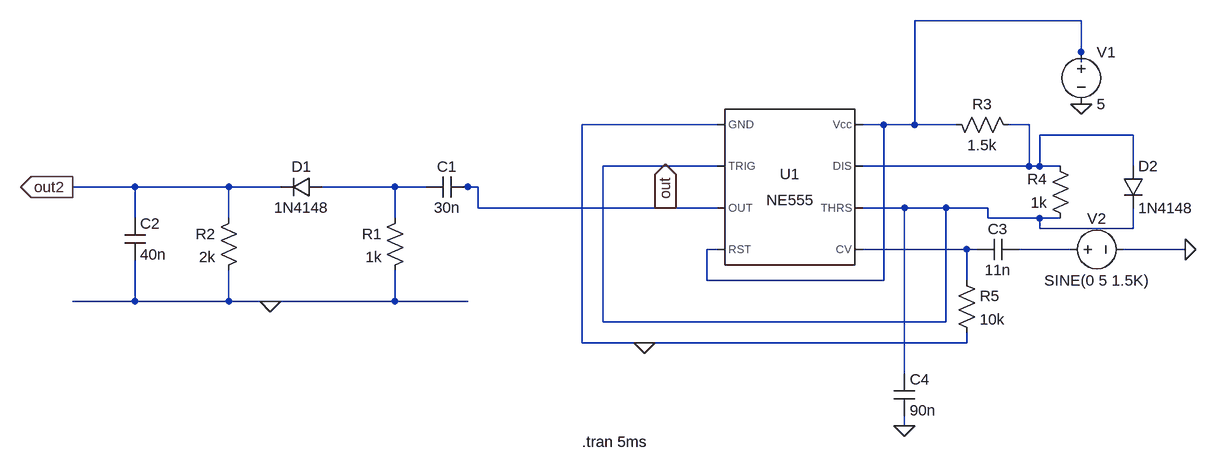
[diagram p0: schematic FM demodulation.asc]
FM demodulation.asc, the LTspice schematic file:
Version 4
SHEET 1 2008 680
WIRE 1824 -192 1568 -192
WIRE 1824 -144 1824 -192
WIRE 1824 -128 1824 -144
WIRE 1264 -32 1056 -32
WIRE 1520 -32 1488 -32
WIRE 1568 -32 1568 -192
WIRE 1568 -32 1520 -32
WIRE 1632 -32 1568 -32
WIRE 1744 -32 1712 -32
WIRE 1904 -16 1760 -16
WIRE 1264 32 1088 32
WIRE 1744 32 1744 -32
WIRE 1744 32 1488 32
WIRE 1760 32 1760 -16
WIRE 1760 32 1744 32
WIRE 1792 32 1760 32
WIRE 1904 32 1904 -16
WIRE 368 64 272 64
WIRE 512 64 368 64
WIRE 592 64 512 64
WIRE 768 64 656 64
WIRE 816 64 768 64
WIRE 880 64 864 64
WIRE 896 64 880 64
WIRE 896 96 896 64
WIRE 1184 96 896 96
WIRE 1264 96 1184 96
WIRE 1552 96 1488 96
WIRE 1616 96 1552 96
WIRE 1680 96 1616 96
WIRE 368 112 368 64
WIRE 512 112 512 64
WIRE 768 112 768 64
WIRE 1680 112 1680 96
WIRE 1760 112 1680 112
WIRE 1792 112 1760 112
WIRE 1760 128 1760 112
WIRE 1904 128 1904 96
WIRE 1904 128 1760 128
WIRE 1264 160 1248 160
WIRE 1648 160 1488 160
WIRE 1664 160 1648 160
WIRE 1808 160 1728 160
WIRE 1984 160 1888 160
WIRE 1248 208 1248 160
WIRE 1520 208 1520 -32
WIRE 1520 208 1248 208
WIRE 1648 208 1648 160
WIRE 368 240 368 176
WIRE 368 240 272 240
WIRE 512 240 512 192
WIRE 512 240 368 240
WIRE 576 240 512 240
WIRE 768 240 768 192
WIRE 768 240 576 240
WIRE 880 240 768 240
WIRE 1088 272 1088 32
WIRE 1616 272 1616 96
WIRE 1616 272 1088 272
WIRE 1056 304 1056 -32
WIRE 1152 304 1056 304
WIRE 1648 304 1648 288
WIRE 1648 304 1152 304
WIRE 1552 352 1552 96
WIRE 1552 432 1552 416
FLAG 1184 96 out
IOPIN 1184 96 Out
FLAG 1824 -64 0
FLAG 1984 160 0
FLAG 1152 304 0
FLAG 1552 432 0
FLAG 576 240 0
FLAG 272 64 out2
IOPIN 272 64 Out
SYMBOL diode 656 80 M270
WINDOW 0 32 32 VTop 2
WINDOW 3 0 32 VBottom 2
SYMATTR InstName D1
SYMATTR Value 1N4148
SYMBOL res 784 96 M0
SYMATTR InstName R1
SYMATTR Value 1k
SYMBOL res 528 96 M0
SYMATTR InstName R2
SYMATTR Value 2k
SYMBOL cap 816 48 M90
WINDOW 0 0 32 VBottom 2
WINDOW 3 32 32 VTop 2
SYMATTR InstName C1
SYMATTR Value 30n
SYMBOL cap 352 176 M180
WINDOW 0 24 56 Left 2
WINDOW 3 24 8 Left 2
SYMATTR InstName C2
SYMATTR Value 40n
SYMBOL Misc\\NE555 1376 64 R0
SYMATTR InstName U1
SYMBOL res 1616 -48 M90
WINDOW 0 0 56 VBottom 2
WINDOW 3 32 56 VTop 2
SYMATTR InstName R3
SYMATTR Value 1.5k
SYMBOL res 1808 128 R180
WINDOW 0 36 76 Left 2
WINDOW 3 36 40 Left 2
SYMATTR InstName R4
SYMATTR Value 1k
SYMBOL voltage 1824 -160 R0
WINDOW 123 0 0 Left 0
WINDOW 39 0 0 Left 0
SYMATTR InstName V1
SYMATTR Value 5
SYMBOL cap 1728 144 R90
WINDOW 0 0 32 VBottom 2
WINDOW 3 32 32 VTop 2
SYMATTR InstName C3
SYMATTR Value 11n
SYMBOL voltage 1792 160 R270
WINDOW 0 32 56 VTop 2
WINDOW 3 -32 56 VBottom 2
WINDOW 123 0 0 Left 0
WINDOW 39 0 0 Left 0
SYMATTR InstName V2
SYMATTR Value SINE(0 5 1.5K)
SYMBOL res 1632 192 R0
SYMATTR InstName R5
SYMATTR Value 10k
SYMBOL diode 1888 32 R0
SYMATTR InstName D2
SYMATTR Value 1N4148
SYMBOL cap 1536 352 R0
SYMATTR InstName C4
SYMATTR Value 90n
TEXT 1056 456 Left 2 !.tran 5ms

The netlist it stands for:
* FM demodulation.asc
D1 N004 out2 1N4148
R1 N004 0 1k
R2 out2 0 2k
C1 N004 out 30n
C2 0 out2 40n
XU1 0 N003 out N001 N005 N003 N002 N001 NE555  ; pins GND TRIG OUT RST CV THRS DIS Vcc
R3 N001 N002 1.5k
R4 N003 N002 1k
V1 N001 0 5
C3 N006 N005 11n
V2 N006 0 SINE(0 5 1.5K)
R5 N005 0 10k
D2 N002 N003 1N4148
C4 N003 0 90n
.model D D
.lib standard.dio
.tran 5ms
.lib NE555.sub
.backanno
.end